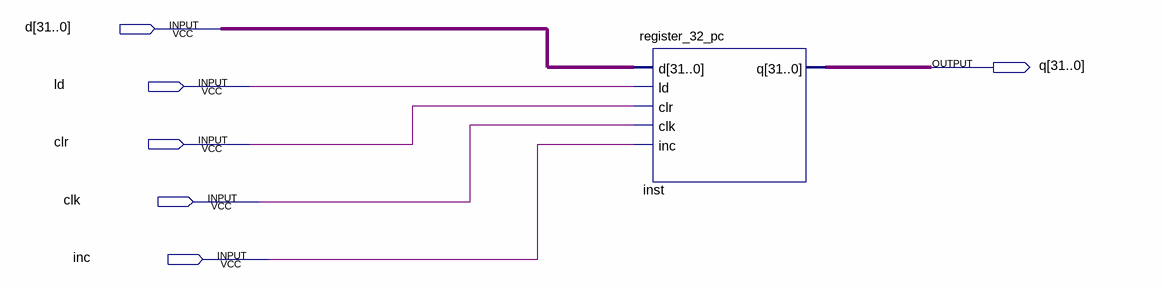
[diagram p0: schematic sheet]
// Quartus schematic q2_pc.bdf as structural Verilog: 1 symbols, 6 pins
module q2_pc (
  input  [31:0] d,
  input  ld,
  input  clr,
  input  clk,
  input  inc,
  output [31:0] q
);

  register_32_pc inst (.d(d), .ld(ld), .clr(clr), .clk(clk), .inc(inc), .q(q));
endmodule
